# EAGLE design untitled (EAGLE 6.4)
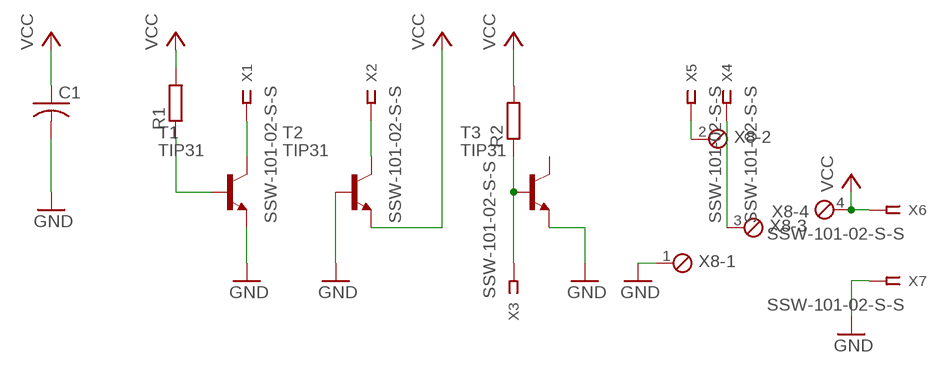
[diagram p0: schematic, sheet 1]

## Parts
C1  C-US050-025X075  [C050-025X075]
R1  R-EU_0204/7  [0204/7]
R2  R-EU_0204/7  [0204/7]
T1  TIP31  [TO220]
T2  TIP31  [TO220]
T3  TIP31  [TO220]
X1  SSW-101-02-S-S  [SSW-101-02-S-S]
X2  SSW-101-02-S-S  [SSW-101-02-S-S]
X3  SSW-101-02-S-S  [SSW-101-02-S-S]
X4  SSW-101-02-S-S  [SSW-101-02-S-S]
X5  SSW-101-02-S-S  [SSW-101-02-S-S]
X6  SSW-101-02-S-S  [SSW-101-02-S-S]
X7  SSW-101-02-S-S  [SSW-101-02-S-S]
X8  MPT4  [4POL254]

## Nets
GND: C1.2 T1.3(E) T2.1(B) T3.3(E) X7.1 X8.1
N$1: R1.1 T1.1(B)
N$2: T1.2(C) X1.1
N$3: T2.2(C) X2.1
N$4: R2.1 T3.1(B) X3.1
N$5: X5.1 X8.2
N$6: X4.1 X8.3
VCC: C1.1 R1.2 R2.2 T2.3(E) X6.1 X8.4
Unconnected: T3.2(C)

## Library data of the parts
C1 = rcl:C-US: CAPACITOR, American symbol
R1 R2 = rcl:R-EU_: RESISTOR, European symbol
T1-T3 = transistor:TIP31: NPN Transistor Medium Power Linear Switching Applications Source: http://onsemi.com
X1-X7 = con-samtec:SSW-101-02-S-S: THROUGH-HOLE .025" SQ POST SOCKET Source: Samtec SSW.pdf; MPN: SSW-101-02-S-S; OC_FARNELL: unknown; OC_NEWARK: 11P9336
X8 = con-phoenix-254:MPT4: PHOENIX CONNECTOR; OC_FARNELL: unknown; OC_NEWARK: unknown

## Board
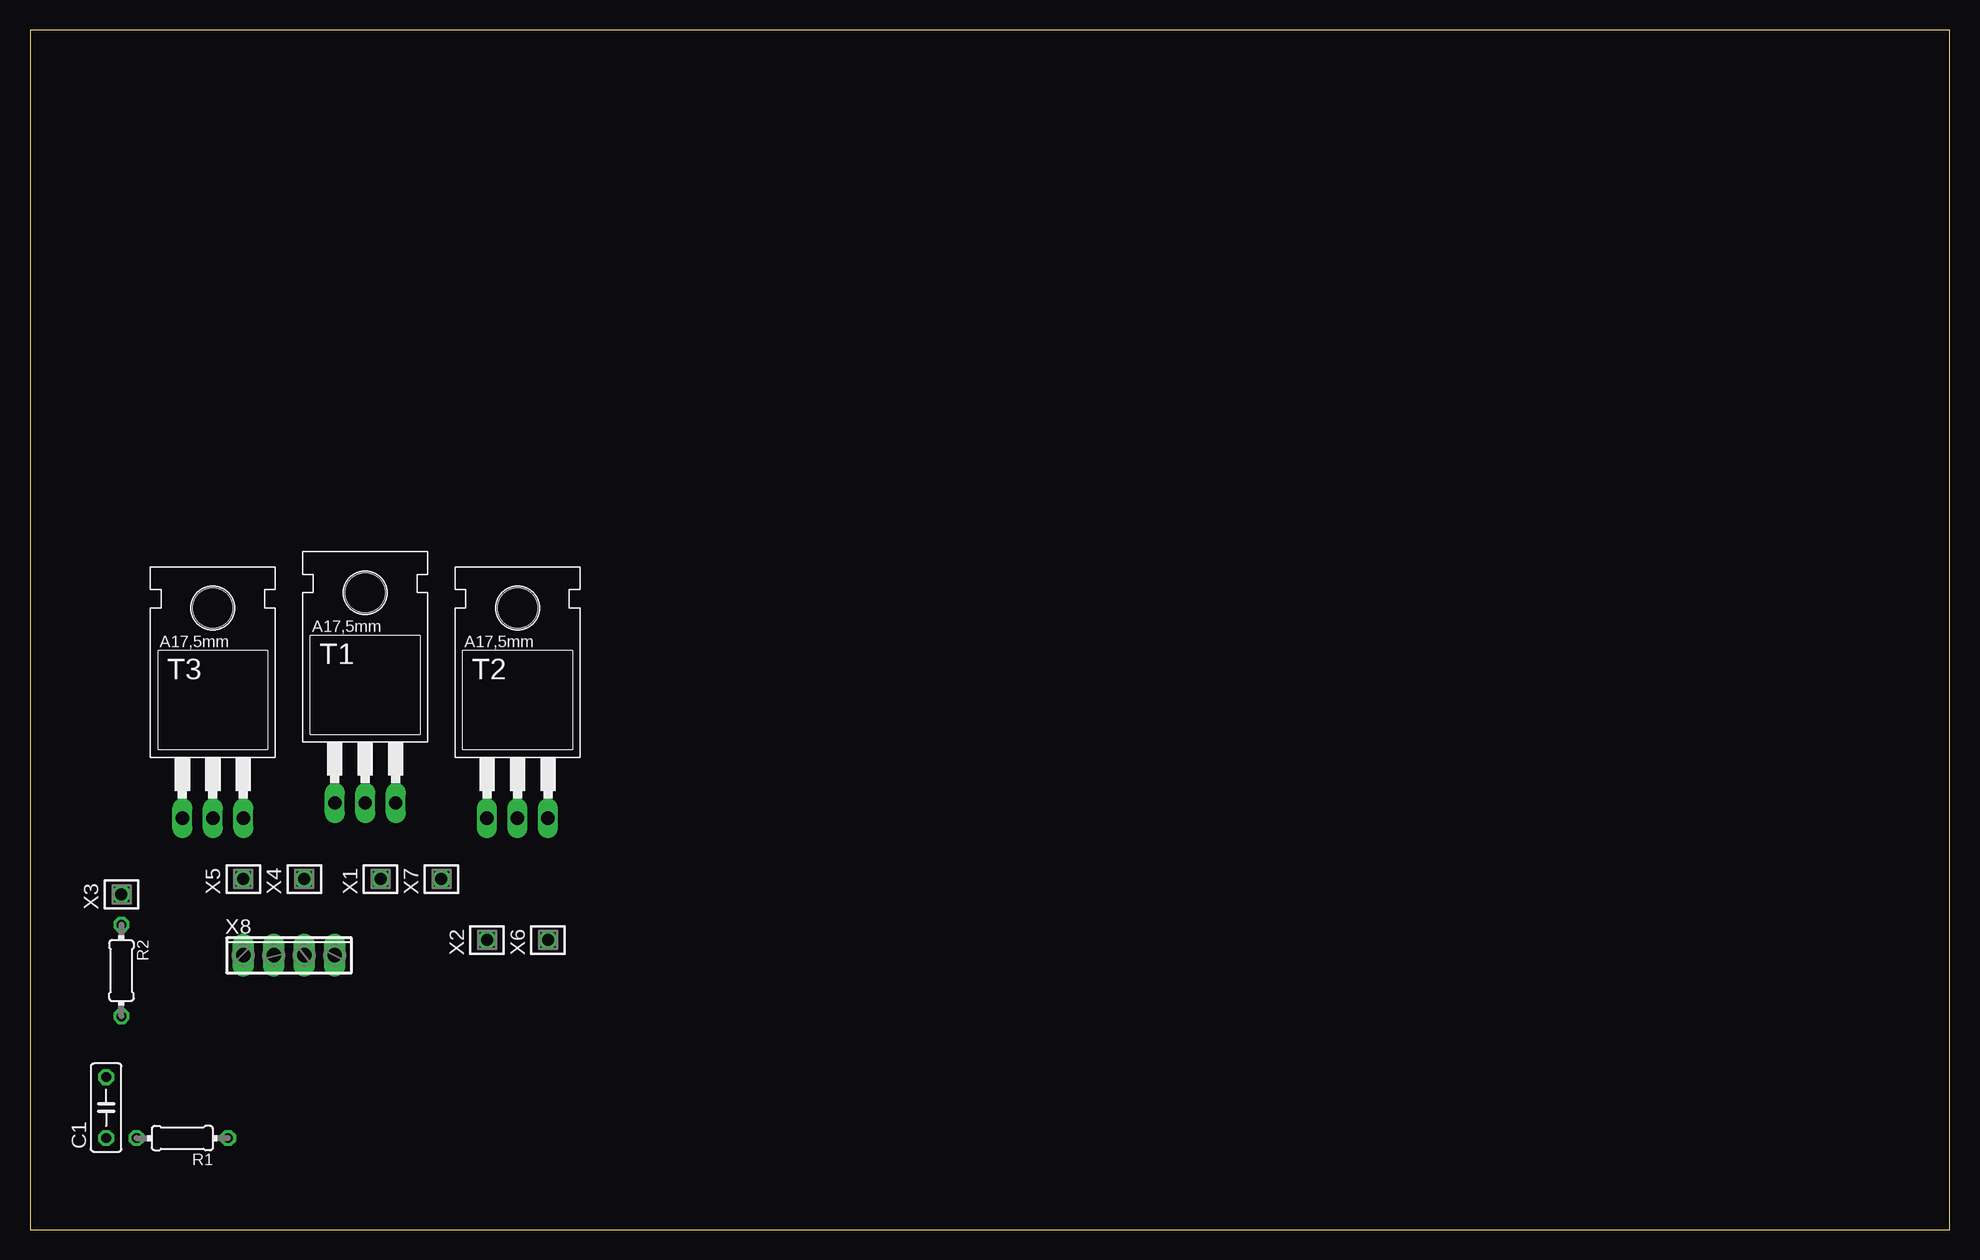
[diagram p1: board, top side]
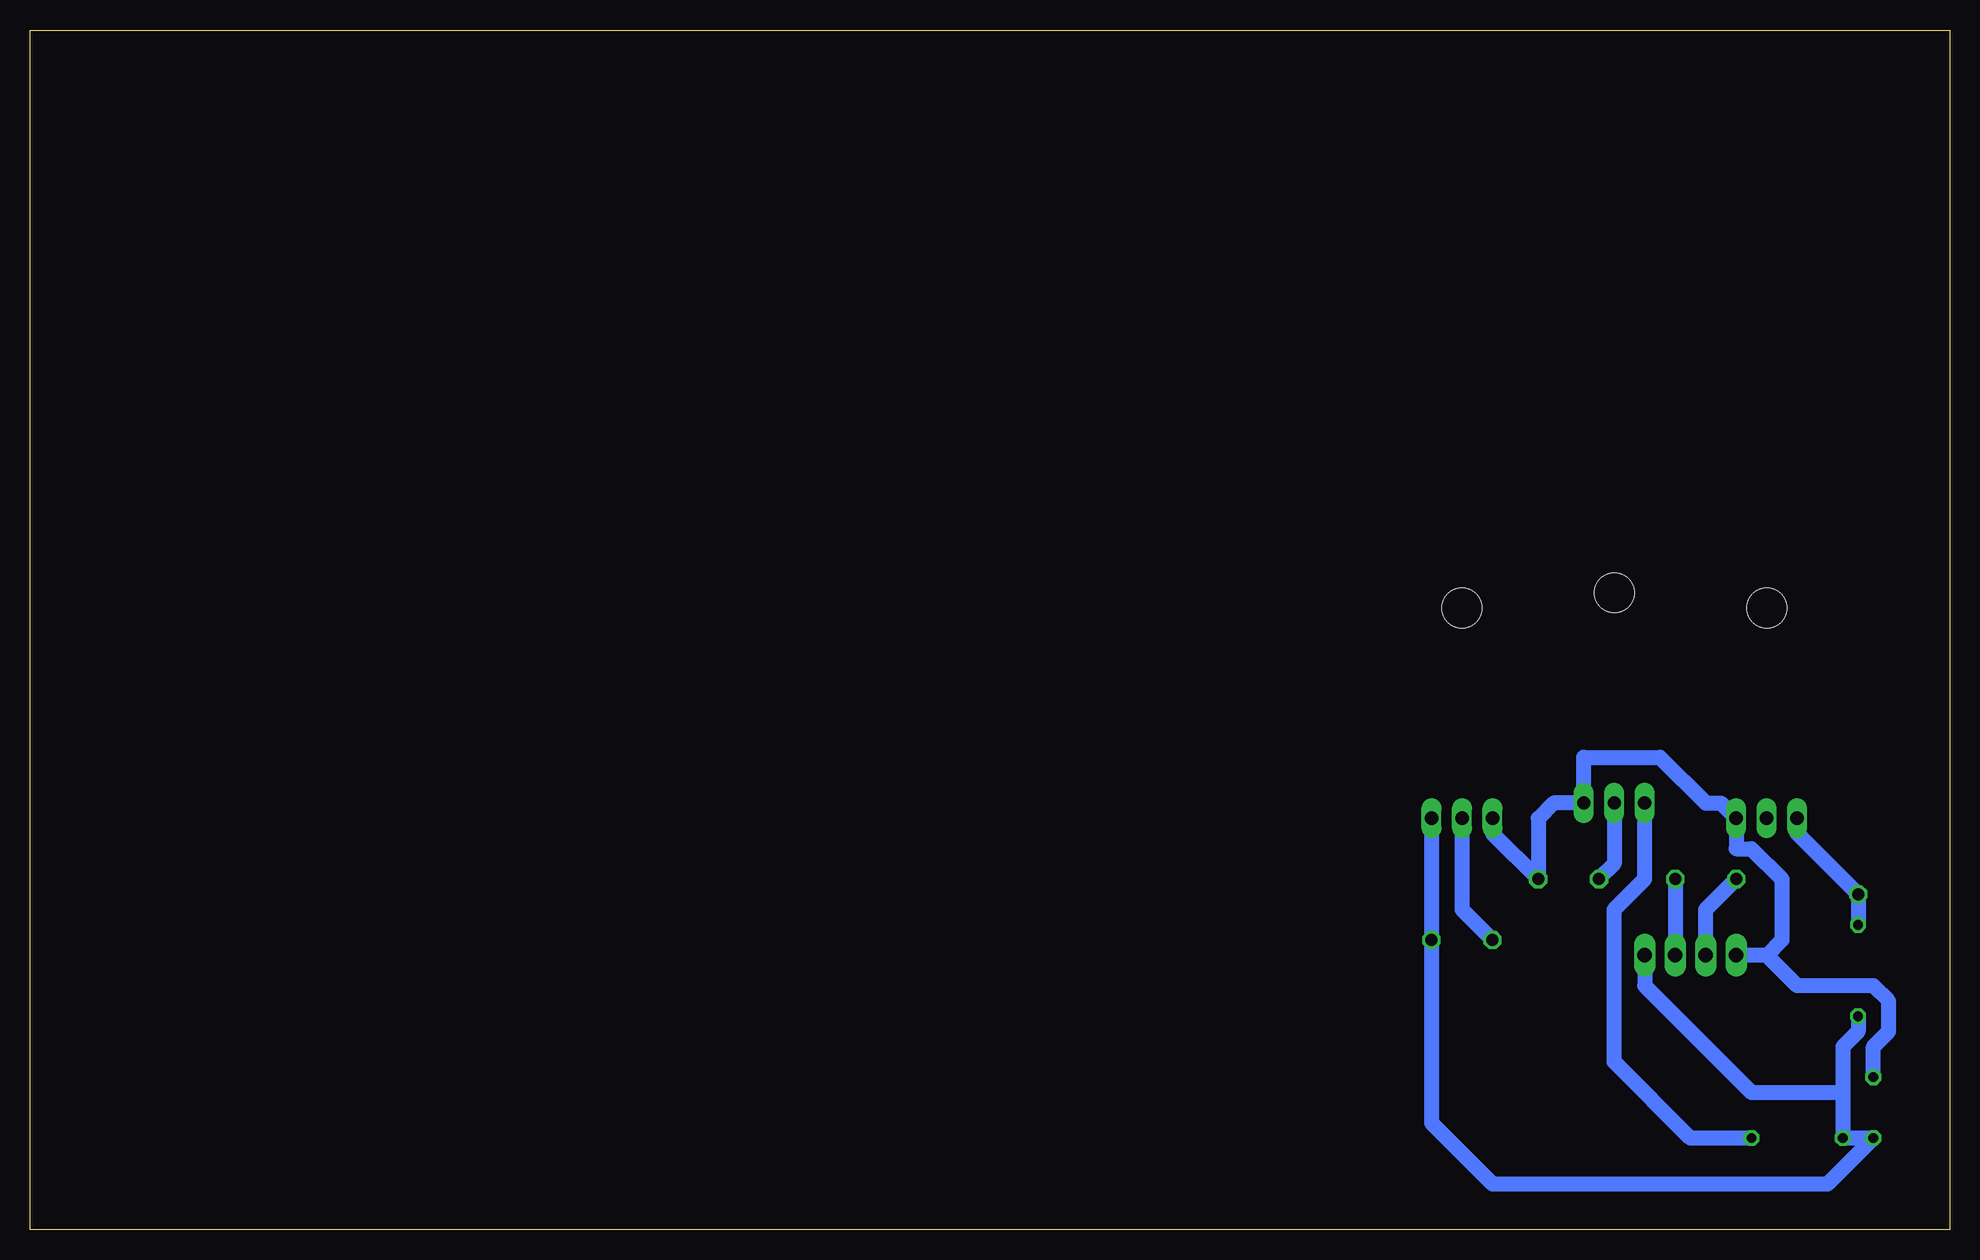
[diagram p2: board, bottom side, seen from below]

Size 160 x 100 mm. Coordinates in mm from the lower left corner, seen from the top.
Outline: 0,0 160,0 160,100 0,100 0,0
Copper layers (1*16): Top 0.035mm / dielectric 1.5mm / Bottom 0.035mm
Design rules "default": minimum track width 10mil, minimum drill 24mil, track to track 8mil, track to pad 8mil, pad to pad 8mil, via to via 8mil, smd to smd 8mil, copper to edge 40mil, drill to drill 8mil, minimum pad ring 10mil, minimum via ring 8mil, stop-mask expansion 4mil, vias tented up to drill 0mil, thermal gap 10mil

### Footprints (pad centres in the part's own frame; a part is rotated, then mirrored left to right if it is on the bottom)
C050-025X075 = drill 0.813 octagon: 1 -2.54,0; 2 2.54,0
0204/7 = drill 0.813 octagon: 1 -3.81,0; 2 3.81,0
TO220 = drill 1.118 long: 1 -2.54,-6.35; 2 0,-6.35; 3 2.54,-6.35 | hole 3.302: 0,11.176
SSW-101-02-S-S = drill 1 pad 1.5 octagon: 1 0,0
4POL254 = drill 1.2 long: 1 -3.81,0; 2 -1.27,0; 3 1.27,0; 4 3.81,0

### Placement (x,y rotation side)
C1  6.35,10.16 90 top
R1  12.7,7.62 180 top
R2  7.62,21.59 270 top
T1  27.94,41.91 0 top
T2  40.64,40.64 0 top
T3  15.24,40.64 0 top
X1  29.21,29.21 0 top
X2  38.1,24.13 0 top
X3  7.62,27.94 0 top
X4  22.86,29.21 0 top
X5  17.78,29.21 0 top
X6  43.18,24.13 0 top
X7  34.29,29.21 0 top
X8  21.59,22.86 0 top

### Tracks (layer width: path | path; a pad name or v marks a point on that pad's centre or on a via)
GND
  Bottom 1.27: T2.1 38.1,33.02 X7.1 34.29,34.29 33.02,35.56 T1.3 30.48,39.37 24.13,39.37 20.32,35.56 19.05,35.56 T3.3 17.78,31.75 16.51,31.75 13.97,29.21 13.97,24.13 15.24,22.86 | C1.2 6.35,15.24 5.08,16.51 5.08,19.05 6.35,20.32 12.7,20.32 15.24,22.86 | 15.24,22.86 X8.1
N$1
  Bottom 1.27: R1.1 21.59,7.62 27.94,13.97 27.94,26.67 25.4,29.21 T1.1
N$2
  Bottom 1.27: T1.2 27.94,30.48 X1.1
N$3
  Bottom 1.27: T2.2 40.64,26.67 X2.1
N$4
  Bottom 1.27: T3.1 12.7,33.02 X3.1 R2.1
N$5
  Bottom 1.27: X8.2 20.32,26.67 X5.1
N$6
  Bottom 1.27: X4.1 X8.3
VCC
  Bottom 1.27: T2.3 X6.1 43.18,8.89 38.1,3.81 10.16,3.81 C1.1 R1.2 8.89,11.43 | R2.2 7.62,16.51 8.89,15.24 8.89,11.43 | X8.4 25.4,20.32 16.51,11.43 8.89,11.43